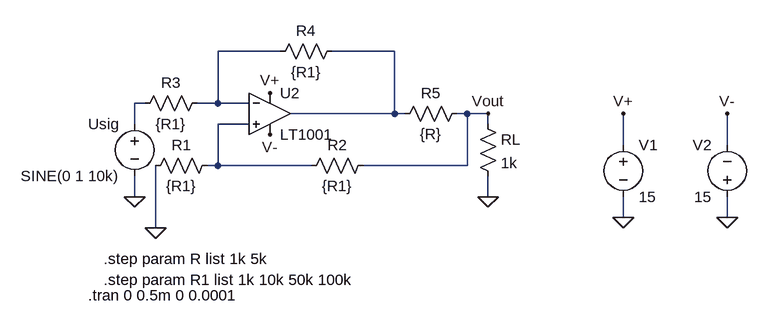
[diagram p0: schematic meros 3o A).asc]
meros 3o A).asc, the LTspice schematic file:
Version 4
SHEET 1 1060 680
WIRE 336 -64 240 -64
WIRE 512 -64 416 -64
WIRE 128 16 112 16
WIRE 240 16 240 -64
WIRE 240 16 208 16
WIRE 288 16 240 16
WIRE 512 32 512 -64
WIRE 512 32 352 32
WIRE 528 32 512 32
WIRE 624 32 608 32
WIRE 656 32 624 32
WIRE 112 48 112 16
WIRE 288 48 240 48
WIRE 656 48 656 32
WIRE 864 80 864 32
WIRE 1024 80 1024 32
WIRE 240 112 240 48
WIRE 240 112 224 112
WIRE 384 112 240 112
WIRE 624 112 624 32
WIRE 624 112 464 112
WIRE 112 160 112 128
WIRE 656 160 656 128
WIRE 864 192 864 160
WIRE 1024 192 1024 160
WIRE 144 208 144 112
FLAG 112 160 0
FLAG 656 160 0
FLAG 144 208 0
FLAG 864 192 0
FLAG 1024 192 0
FLAG 864 32 V+
FLAG 320 0 V+
FLAG 1024 32 V-
FLAG 320 64 V-
FLAG 656 32 Vout
SYMBOL OpAmps\\LT1001 320 -32 R0
SYMATTR InstName U2
SYMBOL res 624 16 R90
WINDOW 0 0 56 VBottom 2
WINDOW 3 32 56 VTop 2
SYMATTR InstName R5
SYMATTR Value {R}
SYMBOL res 432 -80 R90
WINDOW 0 0 56 VBottom 2
WINDOW 3 32 56 VTop 2
SYMATTR InstName R4
SYMATTR Value {R1}
SYMBOL res 224 0 R90
WINDOW 0 0 56 VBottom 2
WINDOW 3 32 56 VTop 2
SYMATTR InstName R3
SYMATTR Value {R1}
SYMBOL res 640 32 R0
SYMATTR InstName RL
SYMATTR Value 1k
SYMBOL res 480 96 R90
WINDOW 0 0 56 VBottom 2
WINDOW 3 32 56 VTop 2
SYMATTR InstName R2
SYMATTR Value {R1}
SYMBOL res 240 96 R90
WINDOW 0 0 56 VBottom 2
WINDOW 3 32 56 VTop 2
SYMATTR InstName R1
SYMATTR Value {R1}
SYMBOL voltage 112 32 M0
WINDOW 123 0 0 Left 0
WINDOW 39 0 0 Left 0
SYMATTR InstName Usig
SYMATTR Value SINE(0 1 10k)
SYMBOL voltage 864 64 R0
WINDOW 123 0 0 Left 0
WINDOW 39 0 0 Left 0
SYMATTR InstName V1
SYMATTR Value 15
SYMBOL voltage 1024 176 R180
WINDOW 0 24 96 Left 2
WINDOW 3 24 16 Left 2
WINDOW 123 0 0 Left 0
WINDOW 39 0 0 Left 0
SYMATTR InstName V2
SYMATTR Value 15
TEXT 64 256 Left 2 !.step param R list 1k 5k
TEXT 64 288 Left 2 !.step param R1 list 1k 10k 50k 100k
TEXT 40 312 Left 2 !.tran 0 0.5m 0 0.0001

The netlist it stands for:
* meros 3o A).asc
XU2 N004 N001 V+ V- N002 LT1001  ; pins In+ In- V+ V- OUT
R5 Vout N002 {R}
R4 N002 N001 {R1}
R3 N001 N003 {R1}
RL Vout 0 1k
R2 Vout N004 {R1}
R1 N004 0 {R1}
V§Usig N003 0 SINE(0 1 10k)
V1 V+ 0 15
V2 0 V- 15
.step param R list 1k 5k
.step param R1 list 1k 10k 50k 100k
.tran 0 0.5m 0 0.0001
.lib LTC.lib
.backanno
.end